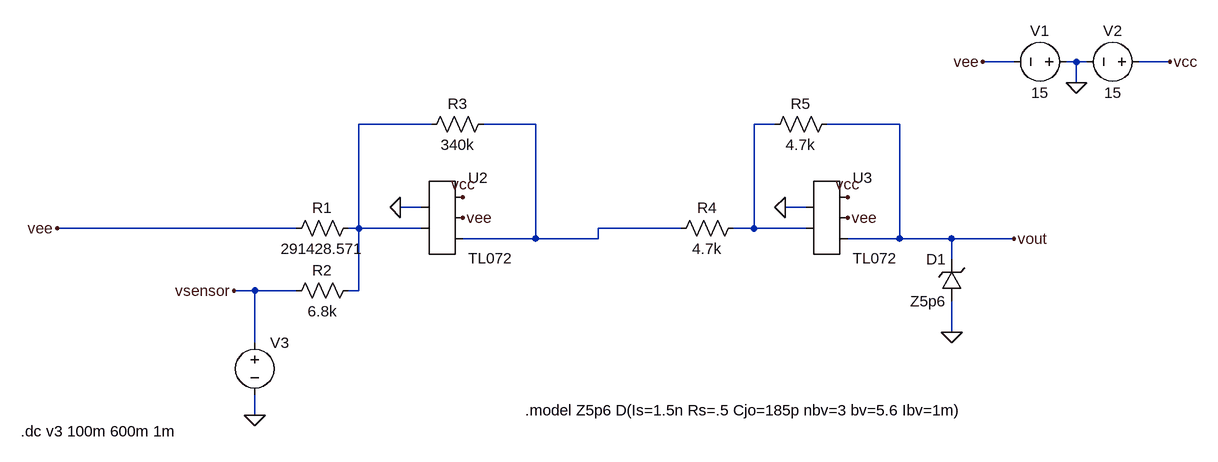
[diagram p0: schematic TC_TP2_EJ6_simulation.asc]
TC_TP2_EJ6_simulation.asc, the LTspice schematic file:
Version 4
SHEET 1 880 680
WIRE 496 -128 448 -128
WIRE 592 -128 576 -128
WIRE 608 -128 592 -128
WIRE 736 -128 688 -128
WIRE 592 -96 592 -128
WIRE -400 -32 -512 -32
WIRE -240 -32 -320 -32
WIRE 128 -32 96 -32
WIRE 320 -32 208 -32
WIRE -416 96 -448 96
WIRE 176 96 144 96
WIRE -608 128 -976 128
WIRE -512 128 -512 -32
WIRE -512 128 -528 128
WIRE -416 128 -512 128
WIRE -16 128 -144 128
WIRE 96 128 96 -32
WIRE 96 128 64 128
WIRE 176 128 96 128
WIRE -240 144 -240 -32
WIRE -240 144 -352 144
WIRE -144 144 -144 128
WIRE -144 144 -240 144
WIRE 320 144 320 -32
WIRE 320 144 240 144
WIRE 400 144 320 144
WIRE 496 144 400 144
WIRE 400 176 400 144
WIRE -672 224 -704 224
WIRE -608 224 -672 224
WIRE -512 224 -512 128
WIRE -512 224 -528 224
WIRE 400 288 400 240
WIRE -672 304 -672 224
WIRE -672 416 -672 384
FLAG -352 80 vcc
FLAG 240 80 vcc
FLAG -352 112 vee
FLAG 240 112 vee
FLAG -448 96 0
FLAG -704 224 vsensor
FLAG 144 96 0
FLAG 496 144 vout
FLAG 400 288 0
FLAG 592 -96 0
FLAG 736 -128 vcc
FLAG 448 -128 vee
FLAG -672 416 0
FLAG -976 128 vee
SYMBOL AutoGenerated\\TL072 -384 112 R0
SYMATTR InstName U2
SYMBOL AutoGenerated\\TL072 208 112 R0
SYMATTR InstName U3
SYMBOL res -512 112 R90
WINDOW 0 0 56 VBottom 2
WINDOW 3 32 56 VTop 2
SYMATTR InstName R1
SYMATTR Value 291428.571
SYMBOL res -512 208 R90
WINDOW 0 0 56 VBottom 2
WINDOW 3 32 56 VTop 2
SYMATTR InstName R2
SYMATTR Value 6.8k
SYMBOL res -304 -48 R90
WINDOW 0 0 56 VBottom 2
WINDOW 3 32 56 VTop 2
SYMATTR InstName R3
SYMATTR Value 340k
SYMBOL res 80 112 R90
WINDOW 0 0 56 VBottom 2
WINDOW 3 32 56 VTop 2
SYMATTR InstName R4
SYMATTR Value 4.7k
SYMBOL res 224 -48 R90
WINDOW 0 0 56 VBottom 2
WINDOW 3 32 56 VTop 2
SYMATTR InstName R5
SYMATTR Value 4.7k
SYMBOL voltage 592 -128 R90
WINDOW 0 -32 56 VBottom 2
WINDOW 3 32 56 VTop 2
WINDOW 123 0 0 Left 0
WINDOW 39 0 0 Left 0
SYMATTR InstName V1
SYMATTR Value 15
SYMBOL voltage 704 -128 R90
WINDOW 0 -32 56 VBottom 2
WINDOW 3 32 56 VTop 2
WINDOW 123 0 0 Left 0
WINDOW 39 0 0 Left 0
SYMATTR InstName V2
SYMATTR Value 15
SYMBOL voltage -672 288 R0
WINDOW 123 0 0 Left 0
WINDOW 39 0 0 Left 0
SYMATTR InstName V3
SYMATTR Value ""
SYMBOL zener 416 240 R180
WINDOW 0 24 64 Left 2
WINDOW 3 24 0 Left 2
SYMATTR InstName D1
SYMATTR Value Z5p6
TEXT -1032 440 Left 2 !.dc v3 100m 600m 1m
TEXT -256 408 Left 2 !.model Z5p6 D(Is=1.5n Rs=.5 Cjo=185p nbv=3 bv=5.6 Ibv=1m)

The netlist it stands for:
* TC_TP2_EJ6_simulation.asc
* U2: TL072 (symbol AutoGenerated\TL072 not available, pins judged from their places): pin1=0 pin2=N001 pin3=vcc pin4=vee pin5=N002
* U3: TL072 (symbol AutoGenerated\TL072 not available, pins judged from their places): pin1=0 pin2=N003 pin3=vcc pin4=vee pin5=vout
R1 N001 vee 291428.571
R2 N001 vsensor 6.8k
R3 N002 N001 340k
R4 N003 N002 4.7k
R5 vout N003 4.7k
V1 0 vee 15
V2 vcc 0 15
V3 vsensor 0
D1 0 vout Z5p6
.model D D
.lib standard.dio
.dc v3 100m 600m 1m
.model Z5p6 D(Is=1.5n Rs=.5 Cjo=185p nbv=3 bv=5.6 Ibv=1m)
.backanno
.end